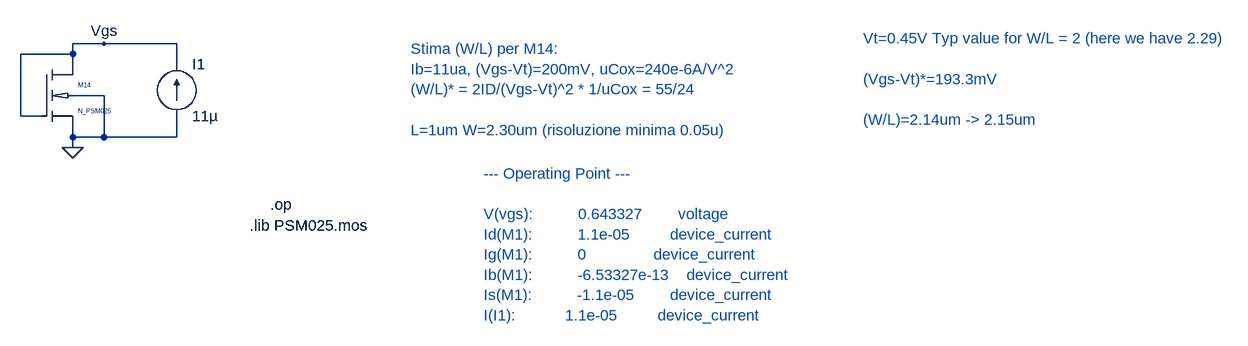
[diagram p0: schematic WL_estimation.asc]
WL_estimation.asc, the LTspice schematic file:
Version 4
SHEET 1 1992 680
WIRE 208 80 160 80
WIRE 320 80 208 80
WIRE 160 96 160 80
WIRE 160 96 80 96
WIRE 160 112 160 96
WIRE 320 112 320 80
WIRE 208 160 160 160
WIRE 80 192 80 96
WIRE 112 192 80 192
WIRE 160 224 160 208
WIRE 208 224 208 160
WIRE 208 224 160 224
WIRE 320 224 320 192
WIRE 320 224 208 224
WIRE 160 240 160 224
FLAG 160 240 0
FLAG 208 80 Vgs
SYMBOL N_PSM025 112 112 R0
SYMATTR InstName M14
SYMATTR Value2 l=1u w=2.3u
SYMBOL current 320 192 M180
WINDOW 0 24 80 Left 2
WINDOW 3 24 0 Left 2
WINDOW 123 0 0 Left 0
WINDOW 39 0 0 Left 0
SYMATTR InstName I1
SYMATTR Value 11µ
TEXT 680 88 Left 2 ;Stima (W/L) per M14:\nIb=11ua, (Vgs-Vt)=200mV, uCox=240e-6A/V^2\n(W/L)* = 2ID/(Vgs-Vt)^2 * 1/uCox = 55/24\n \nL=1um W=2.30um (risoluzione minima 0.05u)
TEXT 464 328 Left 2 !.op
TEXT 432 360 Left 2 !.lib PSM025.mos
TEXT 792 280 Left 2 ;--- Operating Point ---\n \nV(vgs):          0.643327        voltage\nId(M1):          1.1e-05         device_current\nIg(M1):          0               device_current\nIb(M1):          -6.53327e-13    device_current\nIs(M1):          -1.1e-05        device_current\nI(I1):           1.1e-05         device_current
TEXT 1376 72 Left 2 ;Vt=0.45V Typ value for W/L = 2 (here we have 2.29)\n \n(Vgs-Vt)*=193.3mV\n \n(W/L)=2.14um -> 2.15um

The netlist it stands for:
* WL_estimation.asc
M14 Vgs Vgs 0 0 N_PSM025 l=1u w=2.3u
I1 0 Vgs 11µ
.model NMOS NMOS
.model PMOS PMOS
.lib standard.mos
* Stima (W/L) per M14:
* Ib=11ua, (Vgs-Vt)=200mV, uCox=240e-6A/V^2
* (W/L)* = 2ID/(Vgs-Vt)^2 * 1/uCox = 55/24
* L=1um W=2.30um (risoluzione minima 0.05u)
.op
.lib PSM025.mos
* --- Operating Point ---
* V(vgs):          0.643327        voltage
* Id(M1):          1.1e-05         device_current
* Ig(M1):          0               device_current
* Ib(M1):          -6.53327e-13    device_current
* Is(M1):          -1.1e-05        device_current
* I(I1):           1.1e-05         device_current
* Vt=0.45V Typ value for W/L = 2 (here we have 2.29)
* (Vgs-Vt)*=193.3mV
* (W/L)=2.14um -> 2.15um
.lib PSM025.mos
.backanno
.end